# Altium project Trofazni_invertor.PrjPcb
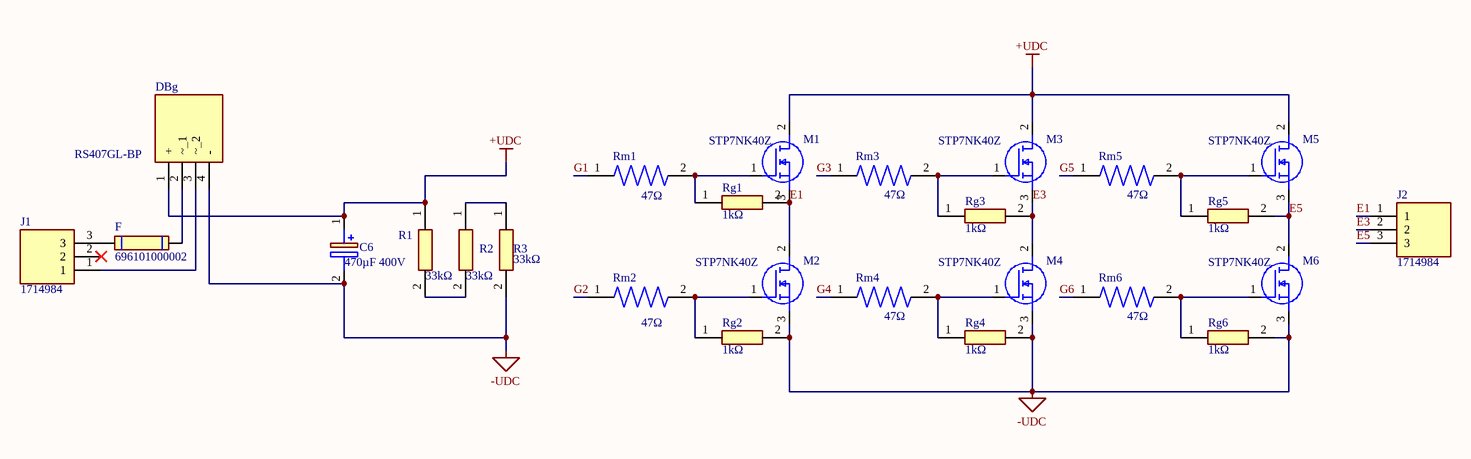
[diagram p0: Energetski_dio.SchDoc]
2 sheets, 57 parts. Net scope: global (net labels, ports and power ports of the same name join across sheets).
Board file: Trofazni_invertor.PcbDoc
Sheets:
  Energetski_dio.SchDoc
  Signalni_dio.SchDoc

## Sheet Energetski_dio.SchDoc
size A4

### Parts
C6  470µF 400V  [6]
DBg  RS407GL-BP  [10]
F  696101000002  [696101000002]
J1  1714984  [3]
J2  1714984  [3]
M1  STP7NK40Z  [2]
M2  STP7NK40Z  [2]
M3  STP7NK40Z  [2]
M4  STP7NK40Z  [2]
M5  STP7NK40Z  [2]
M6  STP7NK40Z  [2]
R1  33kΩ  [18]
R2  33kΩ  [18]
R3  33kΩ  [18]
Rg1  1kΩ  [RESAD1590W60L630D240]
Rg2  1kΩ  [RESAD1590W60L630D240]
Rg3  1kΩ  [RESAD1590W60L630D240]
Rg4  1kΩ  [RESAD1590W60L630D240]
Rg5  1kΩ  [RESAD1590W60L630D240]
Rg6  1kΩ  [RESAD1590W60L630D240]
Rm1  47Ω  [17]
Rm2  47Ω  [17]
Rm3  47Ω  [17]
Rm4  47Ω  [17]
Rm5  47Ω  [17]
Rm6  47Ω  [17]

### Nets
+UDC: C6.1(+) DBg.1(+) M1.2(D) M3.2(D) M5.2(D) R1.1
-UDC: C6.2(-) DBg.4(-) M2.3(S) M4.3(S) M6.3(S) R3.2 Rg2.2 Rg4.2 Rg6.2
E1: J2.1 M1.3(S) M2.2(D) Rg1.2
E3: J2.2 M3.3(S) M4.2(D) Rg3.2
E5: J2.3 M5.3(S) M6.2(D) Rg5.2
G1: Rm1.1
G2: Rm2.1
G3: Rm3.1
G4: Rm4.1
G5: Rm5.1
G6: Rm6.1
NetDBg_2: DBg.2(~_1) F.2
NetDBg_3: DBg.3(~_2) J1.1
NetF_1: F.1 J1.3
NetM1_1: M1.1(G) Rg1.1 Rm1.2
NetM2_1: M2.1(G) Rg2.1 Rm2.2
NetM3_1: M3.1(G) Rg3.1 Rm3.2
NetM4_1: M4.1(G) Rg4.1 Rm4.2
NetM5_1: M5.1(G) Rg5.1 Rm5.2
NetM6_1: M6.1(G) Rg6.1 Rm6.2
NetR1_2: R1.2 R2.2
NetR2_1: R2.1 R3.1

Not connected (* = marked no-connect by the designer): J1 2*

### Library data of the parts
C6 = LLG2G471MELB35_1: Capacitor Polarised; Manufacturer_Name: Nichicon; Datasheet Link: http://nichicon-us.com/english/products/pdfs/e-llg.pdf; Height: 37mm; Manufacturer_Part_Number: LLG2G471MELB35; Mouser Part Number: 647-LLG2G471MELB35; Mouser Price/Stock: https://www.mouser.co.uk/ProductDetail/Nichicon/LLG2G471MELB35?qs=4lWw5qRttGISEzjV5TZARQ%3D%3D; Arrow Part Number: LLG2G471MELB35; Arrow Price/Stock: https://www.arrow.com/en/products/llg2g471melb35/nichicon?region=europe
DBg = RS407GL-BP: Bridge Rectifier; Manufacturer_Name: MCC; Datasheet Link: https://www.mccsemi.com/pdf/Products/RS401GL-RS407GL(RS-4L).pdf; Height: 16.3mm; Manufacturer_Part_Number: RS407GL-BP; Mouser Part Number: 833-RS407GL-BP; Mouser Price/Stock: https://www.mouser.co.uk/ProductDetail/Micro-Commercial-Components-MCC/RS407GL-BP?qs=SdqRYZZ9IxAW3J9C4U9fBg%3D%3D; Arrow Part Number: RS407GL-BP; Arrow Price/Stock: https://www.arrow.com/en/products/rs407gl-bp/micro-commercial-components?region=nac
F = 696101000002: Fuse Block 10 A 250V 1 Circuit Cartridge Through Hole; MF: Wurth Elektronik; Value: *; SnapEDA_Link: https://www.snapeda.com/parts/696101000002/Wurth+Elektronik/view-part/?ref=snap; MP: 696101000002; Purchase-URL: https://pricing.snapeda.com/search/part/696101000002/?ref=eda; Check_prices: https://www.snapeda.com/parts/696101000002/Wurth+Elektronik/view-part/?ref=eda; Availability: In Stock; Price: None; Package: None
J1 J2 = 1714984: Connector; Manufacturer_Name: Phoenix Contact; Datasheet Link: https://www.phoenixcontact.com/online/portal/us/?uri=pxc-oc-itemdetail:pid=1714984&library=usen&pcck=P-11-01-05&tab=1&selectedCategory=ALL; Height: 21.7mm; Manufacturer_Part_Number: 1714984; Mouser Part Number: 651-1714984; Mouser Price/Stock: https://www.mouser.co.uk/ProductDetail/Phoenix-Contact/1714984?qs=cyzODkzcbwBLTTPxtXl6gQ%3D%3D; Arrow Part Number: 1714984; Arrow Price/Stock: https://www.arrow.com/en/products/1714984/phoenix-contact?region=nac
M1-M6 = STP7NK40ZFP: MOSFET (N-Channel); Manufacturer_Name: STMicroelectronics; Datasheet Link: http://www.st.com/web/en/resource/technical/document/datasheet/CD00003040.pdf; Height: 4.6mm; Manufacturer_Part_Number: STP7NK40ZFP; Mouser Part Number: 511-STP7NK40ZFP; Mouser Price/Stock: https://www.mouser.com/Search/Refine.aspx?Keyword=511-STP7NK40ZFP; Arrow Part Number: STP7NK40ZFP; Arrow Price/Stock: https://www.arrow.com/en/products/stp7nk40zfp/stmicroelectronics
R1-R3 = CFR-50JB-52-33K: Resistor; Manufacturer_Name: KEMET; Datasheet Link: https://datasheet.datasheetarchive.com/originals/distributors/Datasheets_SAMA/cf5c7c7b14e59499e9125003e6ee5ce2.pdf; Manufacturer_Part_Number: CFR-50JB-52-33K; Mouser Part Number: 603-CFR-50JB-52-33K; Mouser Price/Stock: https://www.mouser.co.uk/ProductDetail/YAGEO/CFR-50JB-52-33K?qs=oypCK0zG3245HXmmN0J37w%3D%3D; Arrow Part Number: CFR-50JB-52-33K; Arrow Price/Stock: https://www.arrow.com/en/products/cfr-50jb-52-33k/yageo?region=nac
Rg1-Rg6 = CFR-25JB-52-1K: Resistor; Manufacturer_Name: KEMET; Datasheet Link: http://www.mouser.com/datasheet/2/447/Yageo LR_CFR_2013-595289.pdf; Manufacturer_Part_Number: CFR-25JB-52-1K; Mouser Part Number: N/A; Mouser Price/Stock: https://www.mouser.co.uk/ProductDetail/Yageo/CFR-25JB-52-1K/?qs=oypCK0zG326Dzm6bUFS4DQ%3D%3D; Arrow Part Number: CFR-25JB-52-1K; Arrow Price/Stock: https://www.arrow.com/en/products/cfr-25jb-52-1k/yageo
Rm1 Rm2 Rm4-Rm6 = 2-1623928-5: 470 Ohms Â±5% 0.25W, 1/4W Through Hole Resistor Axial - Carbon Film; Tolerance: 5%; Resistance: 470; Voltage_Rating: 200 V; MF: TE Connectivity; Power_Rating: .25 W; Value: *; SnapEDA_Link: https://www.snapeda.com/parts/2-1623928-5/TE+Connectivity/view-part/?ref=snap; EU_RoHS_Compliance: Compliant; Availability: In Stock; Price: None; Package: None; Check_prices: https://www.snapeda.com/parts/2-1623928-5/TE+Connectivity/view-part/?ref=eda; MP: 2-1623928-5; Comment_1: *
Rm3 = 2-1623928-5: 470 Ohms Â±5% 0.25W, 1/4W Through Hole Resistor Axial - Carbon Film; Tolerance: 5%; Resistance: 47; Voltage_Rating: 200 V; MF: TE Connectivity; Power_Rating: .25 W; Value: *; SnapEDA_Link: https://www.snapeda.com/parts/2-1623928-5/TE+Connectivity/view-part/?ref=snap; EU_RoHS_Compliance: Compliant; Availability: In Stock; Price: None; Package: None; Check_prices: https://www.snapeda.com/parts/2-1623928-5/TE+Connectivity/view-part/?ref=eda; MP: 2-1623928-5; Comment_1: *

## Sheet Signalni_dio.SchDoc
size A4
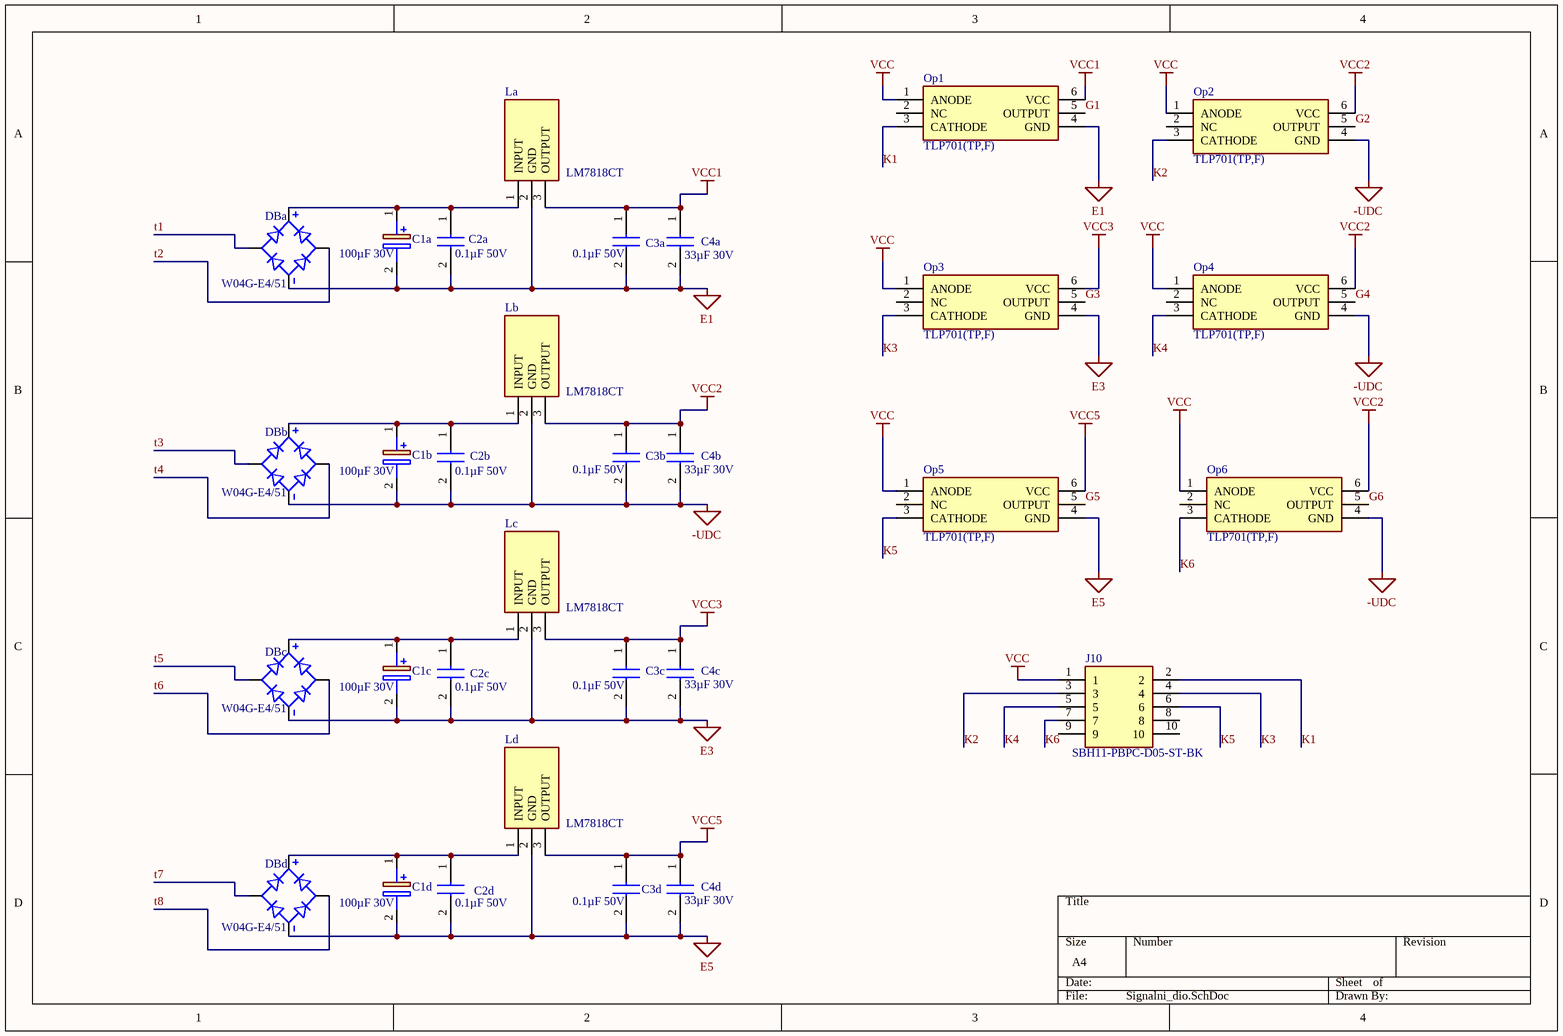
[diagram p1: Signalni_dio.SchDoc]

### Parts
C1a  100µF 30V  [20]
C1b  100µF 30V  [20]
C1c  100µF 30V  [20]
C1d  100µF 30V  [20]
C2a  0.1µF 50V  [8]
C2b  0.1µF 50V  [8]
C2c  0.1µF 50V  [8]
C2d  0.1µF 50V  [8]
C3a  0.1µF 50V  [8]
C3b  0.1µF 50V  [8]
C3c  0.1µF 50V  [8]
C3d  0.1µF 50V  [8]
C4a  33µF 30V  [CAPPRD200W50D500H1250]
C4b  33µF 30V  [CAPPRD200W50D500H1250]
C4c  33µF 30V  [CAPPRD200W50D500H1250]
C4d  33µF 30V  [CAPPRD200W50D500H1250]
DBa  W04G-E4/51  [11]
DBb  W04G-E4/51  [11]
DBc  W04G-E4/51  [11]
DBd  W04G-E4/51  [11]
J10  SBH11-PBPC-D05-ST-BK  [4]
La  LM7818CT  [9]
Lb  LM7818CT  [9]
Lc  LM7818CT  [9]
Ld  LM7818CT  [9]
Op1  TLP701(TP,F)  [1]
Op2  TLP701(TP,F)  [1]
Op3  TLP701(TP,F)  [1]
Op4  TLP701(TP,F)  [1]
Op5  TLP701(TP,F)  [1]
Op6  TLP701(TP,F)  [1]

### Nets
-UDC: C1b.2(-) C2b.2(-) C3b.2(-) C4b.2(-) DBb.NEG Lb.2(GND) Op2.4(GND) Op4.4(GND) Op6.4(GND)
E1: C1a.2(-) C2a.2(-) C3a.2(-) C4a.2(-) DBa.NEG La.2(GND) Op1.4(GND)
E3: C1c.2(-) C2c.2(-) C3c.2(-) C4c.2(-) DBc.NEG Lc.2(GND) Op3.4(GND)
E5: C1d.2(-) C2d.2(-) C3d.2(-) C4d.2(-) DBd.NEG Ld.2(GND) Op5.4(GND)
VCC: J10.1 Op1.1(ANODE) Op2.1(ANODE) Op3.1(ANODE) Op4.1(ANODE) Op5.1(ANODE) Op6.1(ANODE)
VCC1: C3a.1(+) C4a.1(+) La.3(OUTPUT) Op1.6(VCC)
VCC2: C3b.1(+) C4b.1(+) Lb.3(OUTPUT) Op2.6(VCC) Op4.6(VCC) Op6.6(VCC)
VCC3: C3c.1(+) C4c.1(+) Lc.3(OUTPUT) Op3.6(VCC)
VCC5: C3d.1(+) C4d.1(+) Ld.3(OUTPUT) Op5.6(VCC)
G1: Op1.5(OUTPUT)
G2: Op2.5(OUTPUT)
G3: Op3.5(OUTPUT)
G4: Op4.5(OUTPUT)
G5: Op5.5(OUTPUT)
G6: Op6.5(OUTPUT)
K1: J10.2 Op1.3(CATHODE)
K2: J10.3 Op2.3(CATHODE)
K3: J10.4 Op3.3(CATHODE)
K4: J10.5 Op4.3(CATHODE)
K5: J10.6 Op5.3(CATHODE)
K6: J10.7 Op6.3(CATHODE)
t1: DBa.AC2
t2: DBa.AC1
t3: DBb.AC2
t4: DBb.AC1
t5: DBc.AC2
t6: DBc.AC1
t7: DBd.AC2
t8: DBd.AC1
NetC1a_1: C1a.1(+) C2a.1(+) DBa.POS La.1(INPUT)
NetC1b_1: C1b.1(+) C2b.1(+) DBb.POS Lb.1(INPUT)
NetC1c_1: C1c.1(+) C2c.1(+) DBc.POS Lc.1(INPUT)
NetC1d_1: C1d.1(+) C2d.1(+) DBd.POS Ld.1(INPUT)

Not connected (* = marked no-connect by the designer): J10 8 9 10; Op1 2(NC); Op2 2(NC); Op3 2(NC); Op4 2(NC); Op5 2(NC); Op6 2(NC)

### Library data of the parts
C1a C1b C1c C1d = ESK107M035AE3AA: Capacitor Polarised; Manufacturer_Name: KEMET; Datasheet Link: https://content.kemet.com/datasheets/KEM_A4004_ESK.pdf; Height: 12.5mm; Manufacturer_Part_Number: ESK107M035AE3AA; Mouser Part Number: 80-ESK107M035AE3AA; Mouser Price/Stock: https://www.mouser.co.uk/ProductDetail/KEMET/ESK107M035AE3AA?qs=907G%252Bm7SbTtznNeWXOh3WA%3D%3D; Arrow Part Number: ESK107M035AE3AA; Arrow Price/Stock: https://www.arrow.com/en/products/esk107m035ae3aa/kemet-corporation
C2a C2b C2c C2d = K104Z15Y5VF5TL2: Capacitor; Manufacturer_Name: Vishay; Datasheet Link: http://www.mouser.com/ds/2/427/mkseries-205465.pdf; Manufacturer_Part_Number: K104Z15Y5VF5TL2; Mouser Part Number: 594-K104Z15Y5VF5TL2; Mouser Price/Stock: https://www.mouser.co.uk/ProductDetail/Vishay-BC-Components/K104Z15Y5VF5TL2?qs=8fb2TFeI5qG%252BXNQE4bq55w%3D%3D; Arrow Part Number: K104Z15Y5VF5TL2; Arrow Price/Stock: https://www.arrow.com/en/products/k104z15y5vf5tl2/vishay?region=nac
C3a C3b C3c C3d = K104Z15Y5VF5TL2_1: Capacitor; Manufacturer_Name: Vishay; Datasheet Link: http://www.mouser.com/ds/2/427/mkseries-205465.pdf; Manufacturer_Part_Number: K104Z15Y5VF5TL2; Mouser Part Number: 594-K104Z15Y5VF5TL2; Mouser Price/Stock: https://www.mouser.co.uk/ProductDetail/Vishay-BC-Components/K104Z15Y5VF5TL2?qs=8fb2TFeI5qG%252BXNQE4bq55w%3D%3D; Arrow Part Number: K104Z15Y5VF5TL2; Arrow Price/Stock: https://www.arrow.com/en/products/k104z15y5vf5tl2/vishay?region=nac
C4a C4b C4c C4d = ESH336M035AC3AA: Capacitor; Manufacturer_Name: KEMET; Datasheet Link: https://content.kemet.com/datasheets/KEM_A4005_ESH.pdf; Height: 12.5mm; Manufacturer_Part_Number: ESH336M035AC3AA; Mouser Part Number: 80-ESH336M035AC3AA; Mouser Price/Stock: https://www.mouser.co.uk/ProductDetail/KEMET/ESH336M035AC3AA?qs=w9hhVRgtvflENp8Xu64Lcw%3D%3D; Arrow Part Number: ESH336M035AC3AA; Arrow Price/Stock: https://www.arrow.com/en/products/esh336m035ac3aa/kemet-corporation?region=nac
DBa DBb DBc DBd = W04G-E4/51: Bridge Rectifier Single Phase Standard 400 V Through Hole WOG; MF: Vishay; Value: *; SnapEDA_Link: https://www.snapeda.com/parts/W04G-E4/51/Vishay+Semiconductor+Diodes+Division/view-part/?ref=snap; Purchase-URL: https://pricing.snapeda.com/search/part/W04G-E4/51/?ref=eda; Availability: In Stock; Price: None; Package: WOG-4 Vishay Semiconductor Diodes Division; Check_prices: https://www.snapeda.com/parts/W04G-E4/51/Vishay+Semiconductor+Diodes+Division/view-part/?ref=eda; MP: W04G-E4/51
J10 = SBH11-PBPC-D05-ST-BK: Connector; Manufacturer_Name: Sullins; Datasheet Link: https://s3.amazonaws.com/catalogspreads-pdf/PAGE122%20.100%20SBH11%20SERIES%20MALE%20BOX%20HDR%20ST%20RA%20SMT.pdf; Height: 8.8mm; Manufacturer_Part_Number: SBH11-PBPC-D05-ST-BK
La Lb Lc Ld = LM7818CT: Integrated Circuit; Manufacturer_Name: onsemi; Datasheet Link: https://componentsearchengine.com/Datasheets/2/LM7818CT.pdf; Height: 4.7mm; Manufacturer_Part_Number: LM7818CT; Mouser Part Number: 512-LM7818CT; Mouser Price/Stock: https://www.mouser.co.uk/ProductDetail/ON-Semiconductor-Fairchild/LM7818CT?qs=VOMQJJE%252BBNlJ%252BsI8cCErUA%3D%3D; Arrow Part Number: LM7818CT; Arrow Price/Stock: https://www.arrow.com/en/products/lm7818ct/on-semiconductor
Op1-Op6 = TLP701_TP_: Phototransistor; Manufacturer_Name: Toshiba; Manufacturer_Part_Number: TLP701(TP); Datasheet Link: https://toshiba.semicon-storage.com/info/docget.jsp?did=1642&prodName=TLP701; Height: 4.25mm

## Nets that join several sheets
-UDC: Energetski_dio (9 pins), Signalni_dio (9 pins)
E1: Energetski_dio (J2.1 M1.3 M2.2 Rg1.2), Signalni_dio (7 pins)
E3: Energetski_dio (J2.2 M3.3 M4.2 Rg3.2), Signalni_dio (7 pins)
E5: Energetski_dio (J2.3 M5.3 M6.2 Rg5.2), Signalni_dio (7 pins)
G1: Energetski_dio (Rm1.1), Signalni_dio (Op1.5)
G2: Energetski_dio (Rm2.1), Signalni_dio (Op2.5)
G3: Energetski_dio (Rm3.1), Signalni_dio (Op3.5)
G4: Energetski_dio (Rm4.1), Signalni_dio (Op4.5)
G5: Energetski_dio (Rm5.1), Signalni_dio (Op5.5)
G6: Energetski_dio (Rm6.1), Signalni_dio (Op6.5)